# EAGLE schematic Zio nRF52832 Dev Board V1.0 (EAGLE 9.1.1)
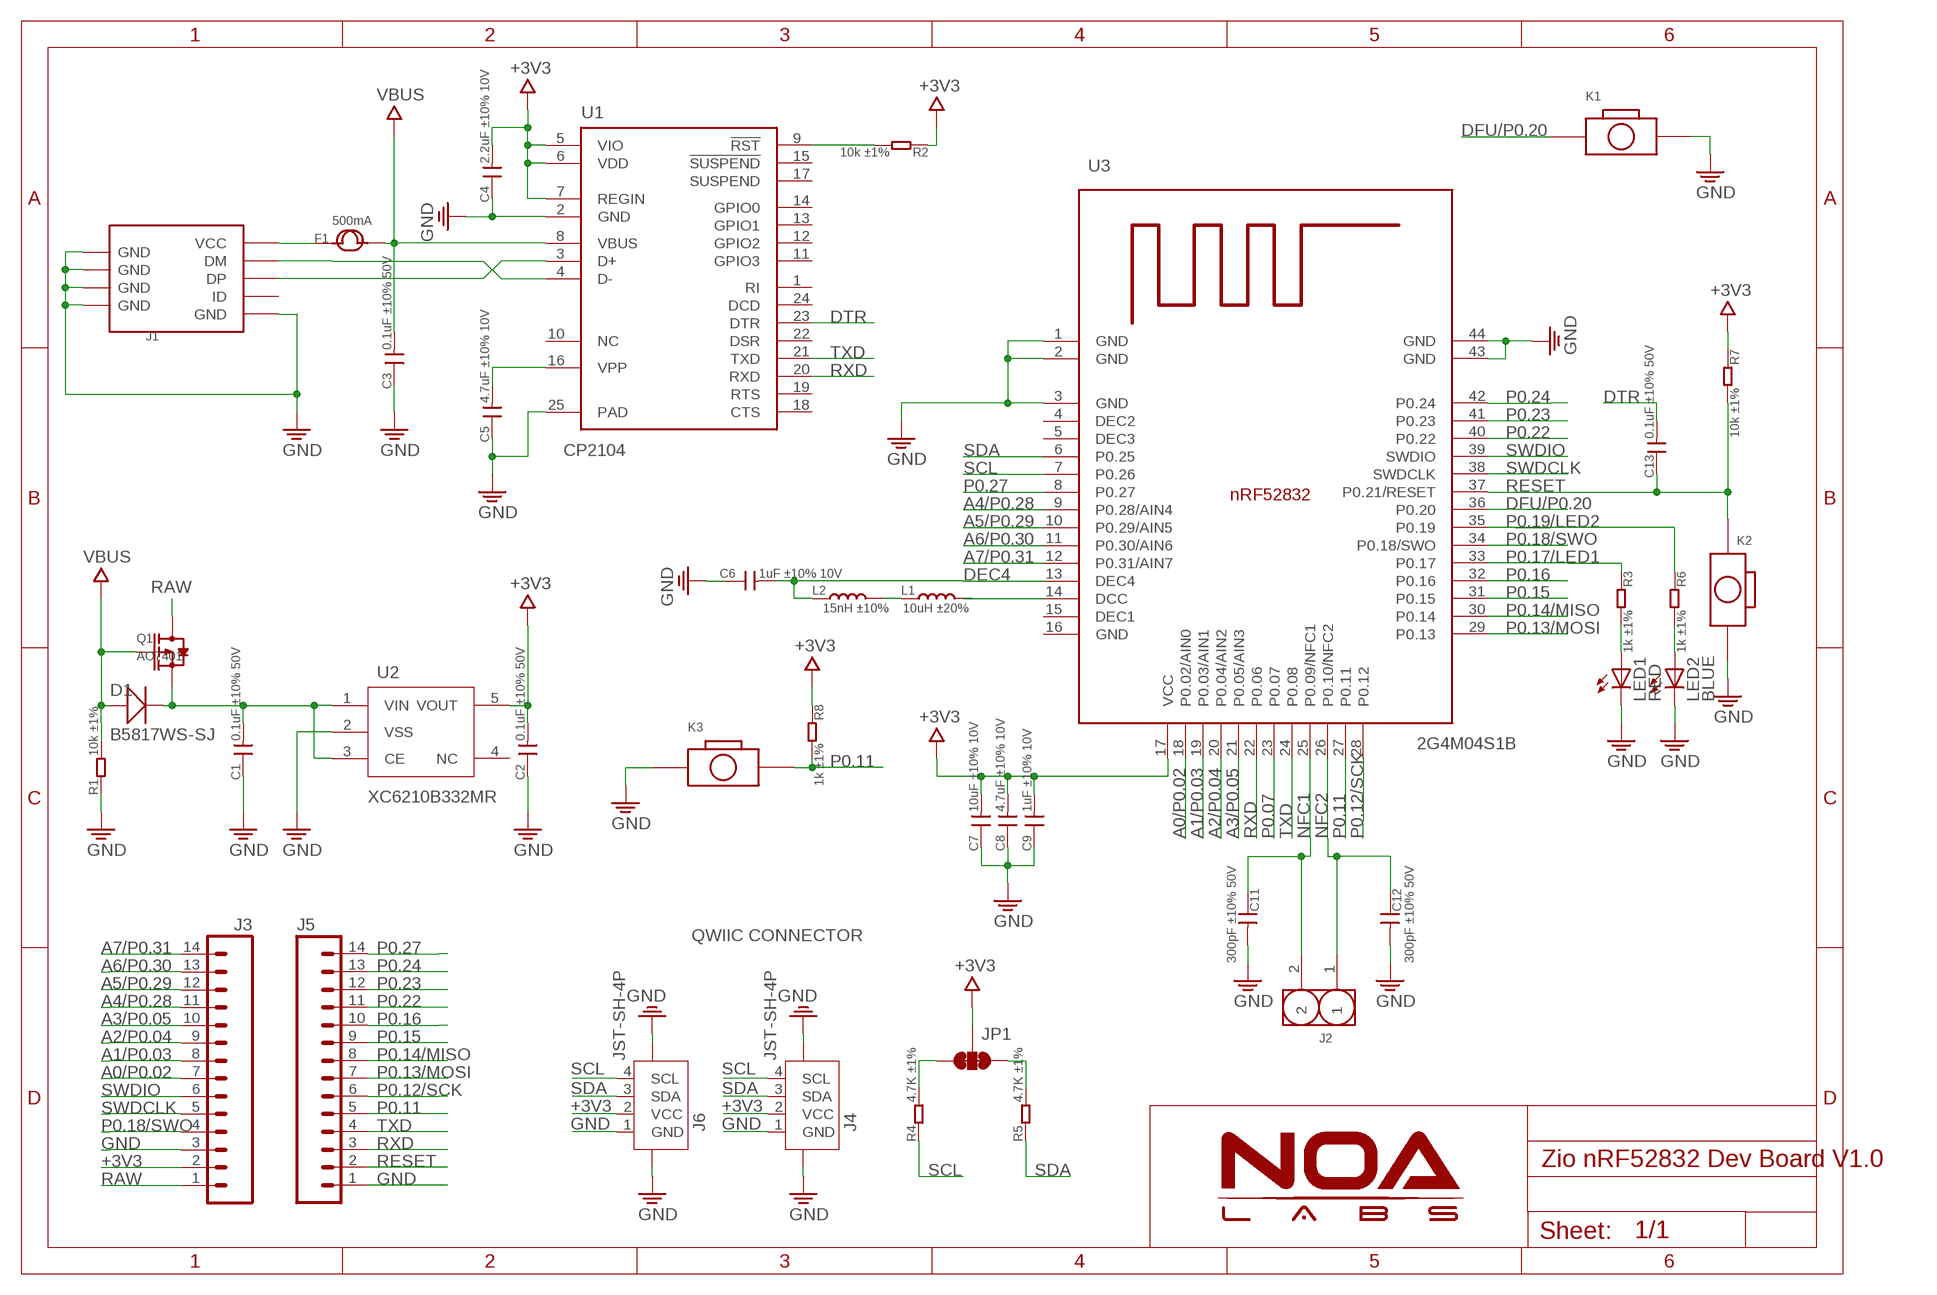
[diagram p0: schematic, sheet 1]

## Parts
C1  0.1uF ±10% 50V  C-0603  [C0603]
C2  0.1uF ±10% 50V  C-0603  [C0603]
C3  0.1uF ±10% 50V  C-0603  [C0603]
C4  2.2uF ±10% 10V  C-0603  [C0603]
C5  4.7uF ±10% 10V  C-0603  [C0603]
C6  1uF ±10% 10V  C-0603  [C0603]
C7  10uF ±10% 10V  C-0603  [C0603]
C8  4.7uF ±10% 10V  C-0603  [C0603]
C9  1uF ±10% 10V  C-0603  [C0603]
C11  300pF ±10% 50V  C-0603  [C0603]
C12  300pF ±10% 50V  C-0603  [C0603]
C13  0.1uF ±10% 50V  C-0603  [C0603]
D1  B5817WS-SJ  D-0805  [SOD323]
F1  500mA  FUSE1206  [1206]
J1  USB-MICROE  [MICRO-SMD]
J2  HEADER-2P-65/35MIL  [2P-2.54-65/35MIL]
J3  HEADER-14P  [14P-SCREW-2.54]
J4  JST-SH-4P  [JST-SH-4P-90]
J5  HEADER-14P  [14P-SCREW-2.54]
J6  JST-SH-4P  [JST-SH-4P-90]
JP1  SMT-JUMPER_3_2-NC_TRACE  [SMT-JUMPER_3_2-NC_TRACE]
K1  BOTTON-2PSKRKAEE020  [SKRKAEE020]
K2  BOTTON-2PSKRKAEE020  [SKRKAEE020]
K3  BOTTON-2PSKRKAEE020  [SKRKAEE020]
L1  10uH ±20%  L-0603  [L0603]
L2  15nH ±10%  L-0402  [L0402]
LED1  RED  LEDCHIPLED_0603  [CHIPLED_0603]
LED2  BLUE  LEDCHIPLED_0603  [CHIPLED_0603]
Q1  AO7401  MOSFET-P-323  [SOT-323]
R1  10k ±1%  R-0603  [R0603]
R2  10k ±1%  R-0603  [R0603]
R3  1k ±1%  R-0603  [R0603]
R4  4.7K ±1%  R-0603  [R0603]
R5  4.7K ±1%  R-0603  [R0603]
R6  1k ±1%  R-0603  [R0603]
R7  10k ±1%  R-0603  [R0603]
R8  1k ±1%  R-0603  [R0603]
U1  CP2104  [QFN24_4X4]
U2  XC6210B332MR  XC6210  [SOT23-5]
U3  2G4M04S1B  2G4M04S1B_NRF52832  [2G4M04S1B_NRF52832]

## Nets
+3V3: C2.2 C4.2 C7.2 C8.2 C9.2 J3.2 J4.2(VCC) J6.2(VCC) JP1.2 R2.1 R7.1 R8.1 U1.5(VIO) U1.6(VDD) U1.7(REGIN) U2.5(VOUT) U3.17(VCC)
A0/P0.02: J3.7 U3.18(P0.02/AIN0)
A1/P0.03: J3.8 U3.19(P0.03/AIN1)
A2/P0.04: J3.9 U3.20(P0.04/AIN2)
A3/P0.05: J3.10 U3.21(P0.05/AIN3)
A4/P0.28: J3.11 U3.9(P0.28/AIN4)
A5/P0.29: J3.12 U3.10(P0.29/AIN5)
A6/P0.30: J3.13 U3.11(P0.30/AIN6)
A7/P0.31: J3.14 U3.12(P0.31/AIN7)
DEC4: C6.2 L2.1 U3.13(DEC4)
DFU/P0.20: K1.1 U3.36(P0.20)
DTR: C13.2 U1.23(DTR)
GND: C1.1 C2.1 C3.1 C4.1 C5.1 C6.1 C7.1 C8.1 C9.1 C11.2 C12.2 J1.P5(GND) J1.S1(GND) J1.S2(GND) J1.S3(GND) J1.S4(GND) J3.3 J4.1(GND) J4.5 J4.6 J5.1 J6.1(GND) J6.5 J6.6 K1.2 K2.2 K3.1 LED1.C LED2.C R1.1 U1.2(GND) U1.25(PAD) U2.2(VSS) U3.1(GND) U3.2(GND) U3.3(GND) U3.43(GND) U3.44(GND)
N$1: L1.1 L2.2
N$2: J1.P3(DP) U1.3(D+)
N$3: R2.2 U1.9(!RST!)
N$4: J1.P2(DM) U1.4(D-)
N$5: F1.1 J1.P1(VCC)
N$6: LED2.A R6.2
N$7: C5.2 U1.16(VPP)
N$8: LED1.A R3.2
N$14: L1.2 U3.14(DCC)
N$34: JP1.3 R4.2
N$36: JP1.1 R5.2
NFC1: C11.1 J2.2 U3.25(P0.09/NFC1)
NFC2: C12.1 J2.1 U3.26(P0.10/NFC2)
P0.07: U3.23(P0.07)
P0.11: J5.5 K3.2 R8.2 U3.27(P0.11)
P0.12/SCK: J5.6 U3.28(P0.12)
P0.13/MOSI: J5.7 U3.29(P0.13)
P0.14/MISO: J5.8 U3.30(P0.14)
P0.15: J5.9 U3.31(P0.15)
P0.16: J5.10 U3.32(P0.16)
P0.17/LED1: R3.1 U3.33(P0.17)
P0.18/SWO: J3.4 U3.34(P0.18/SWO)
P0.19/LED2: R6.1 U3.35(P0.19)
P0.22: J5.11 U3.40(P0.22)
P0.23: J5.12 U3.41(P0.23)
P0.24: J5.13 U3.42(P0.24)
P0.27: J5.14 U3.8(P0.27)
RAW: J3.1 Q1.3(D)
RESET: C13.1 J5.2 K2.1 R7.2 U3.37(P0.21/RESET)
RXD: J5.3 U1.20(RXD) U3.22(P0.06)
SCL: J4.4(SCL) J6.4(SCL) R4.1 U3.7(P0.26)
SDA: J4.3(SDA) J6.3(SDA) R5.1 U3.6(P0.25)
SWDCLK: J3.5 U3.38(SWDCLK)
SWDIO: J3.6 U3.39(SWDIO)
TXD: J5.4 U1.21(TXD) U3.24(P0.08)
VBUS: C3.2 D1.+ F1.2 Q1.1(G) R1.2 U1.8(VBUS)
VIN: C1.2 D1.- Q1.2(S) U2.1(VIN) U2.3(CE)
Unconnected: J1.P4(ID) U1.1(RI) U1.10(NC) U1.11(GPIO3) U1.12(GPIO2) U1.13(GPIO1) U1.14(GPIO0) U1.15(!SUSPEND) U1.17(SUSPEND) U1.18(CTS) U1.19(RTS) U1.22(DSR) U1.24(DCD) U2.4(NC) U3.4(DEC2) U3.5(DEC3) U3.15(DEC1) U3.16(GND)

## Notes on the sheet
- QWIIC CONNECTOR

## Library data of the parts
C1-C9 C11-C13 = RCL:C
D1 = Discrete_NOA:D*
F1 = Discrete:FUSE
J1 = Connector_NOA:USB-MICROE
J2 = Connector_NOA:HEADER-2P
J3 J5 = Connector:HEADER-14P: Header 14 Standard 14-pin 0.1" header. Use with straight break away headers (SKU : PRT-00116), right angle break away headers (PRT-00553), swiss pins (PRT-00743), machine pins (PRT-00117), and female headers (PRT-00115).
J4 J6 = Connector:JST-SH-4P
JP1 = NOA-Jumpers:SMT-JUMPER_3_2-NC_TRACE
K1-K3 = Discrete:BOTTON-2P
L1 L2 = RCL:L
LED1 LED2 = Discrete_NOA:LED
Q1 = Discrete_NOA:MOSFET-P
R1-R8 = RCL:R
U1 = IC_NOA:CP2104: Single-Chip USB to UART Bridge Source: www.silabs.com .. CP2101.pdf / cp2102.pdf. Spark Fun Electronics SKU : COM-00310
U2 = IC_NOA:XC6210
U3 = Other_Module:2G4M04S1B_NRF52832